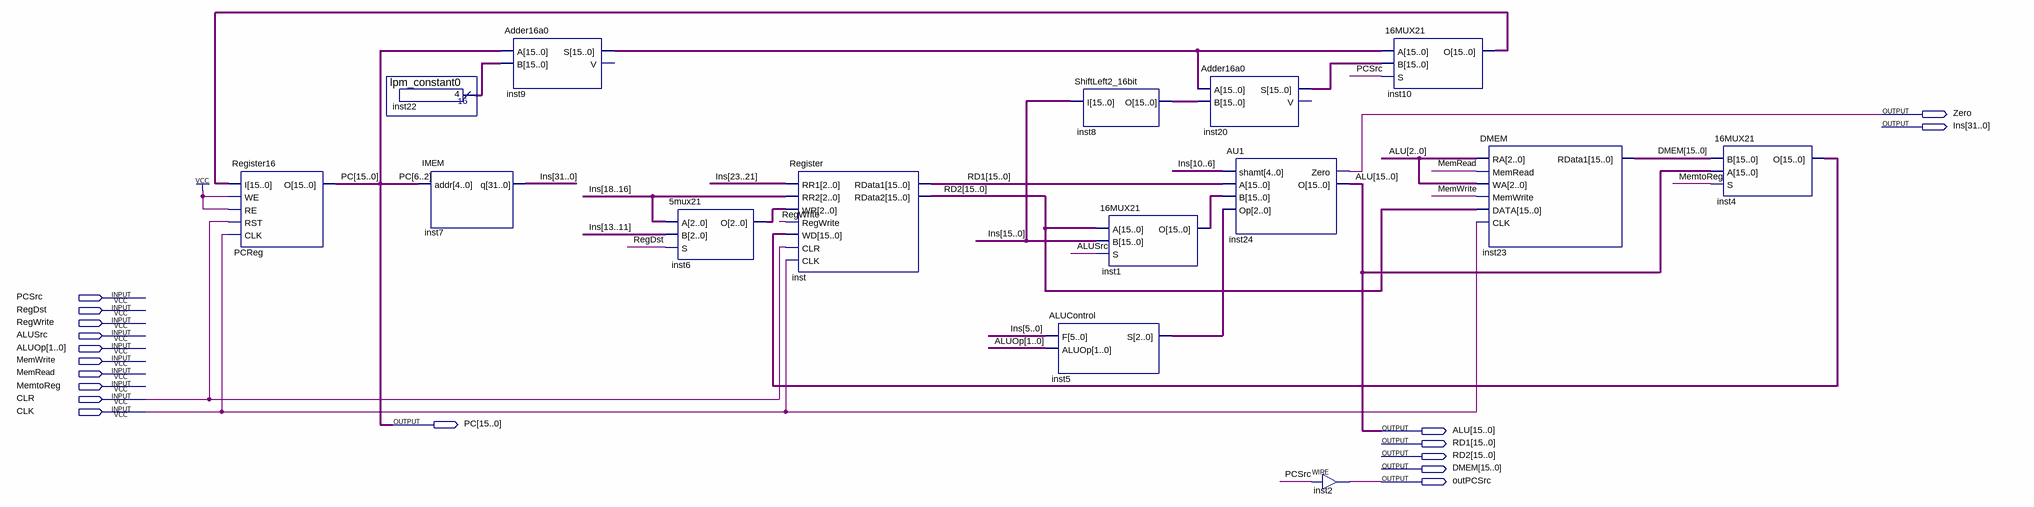
[diagram p0: schematic sheet]
// Quartus schematic Datapath.bdf as structural Verilog: 15 symbols, 18 pins
module Datapath (
  input  PCSrc,
  input  RegDst,
  input  RegWrite,
  input  ALUSrc,
  input  [1:0] ALUOp,
  input  MemWrite,
  input  MemRead,
  input  MemtoReg,
  input  CLR,
  input  CLK,
  output Zero,
  output [31:0] Ins,
  output [15:0] PC,
  output [15:0] ALU,
  output [15:0] RD1,
  output [15:0] RD2,
  output [15:0] DMEM,
  output outPCSrc
);

  wire [2:0] inst5_s, inst6_o;
  wire [15:0] inst1_o, inst4_o, inst8_o, inst9_s, inst10_o, inst20_s, inst22_result;

  Register16 PCReg (.I(inst10_o), .WE(1'b1), .RE(1'b1), .RST(CLR), .CLK(CLK), .O(PC));
  lpm_constant0 inst22 (.result(inst22_result));
  IMEM inst7 (.addr(PC[6:2]), .q(Ins));
  Adder16a0 inst9 (.A(PC), .B(inst22_result), .S(inst9_s));  // open: V
  \5mux21  inst6 (.A(Ins[18:16]), .B(Ins[13:11]), .S(RegDst), .O(inst6_o));
  Register inst (
    .RR1(Ins[23:21]), .RR2(Ins[18:16]), .WR(inst6_o), .RegWrite(RegWrite), .WD(inst4_o), .CLR(CLR),
    .CLK(CLK), .RData1(RD1), .RData2(RD2));
  ShiftLeft2_16bit inst8 (.I(Ins[15:0]), .O(inst8_o));
  ALUControl inst5 (.F(Ins[5:0]), .ALUOp(ALUOp), .S(inst5_s));
  \16MUX21  inst1 (.A(RD2), .B(Ins[15:0]), .S(ALUSrc), .O(inst1_o));
  Adder16a0 inst20 (.A(inst9_s), .B(inst8_o), .S(inst20_s));  // open: V
  AU1 inst24 (.shamt(Ins[10:6]), .A(RD1), .B(inst1_o), .Op(inst5_s), .Zero(Zero), .O(ALU));
  assign outPCSrc = PCSrc;  // WIRE inst2
  \16MUX21  inst10 (.A(inst9_s), .B(inst20_s), .S(PCSrc), .O(inst10_o));
  DMEM inst23 (
    .RA(ALU[2:0]), .MemRead(MemRead), .WA(ALU[2:0]), .MemWrite(MemWrite), .DATA(RD2), .CLK(CLK), .RData1(DMEM));
  \16MUX21  inst4 (.A(ALU), .B(DMEM), .S(MemtoReg), .O(inst4_o));
endmodule
